# EAGLE design ButtonBoard (EAGLE 9.4.2)
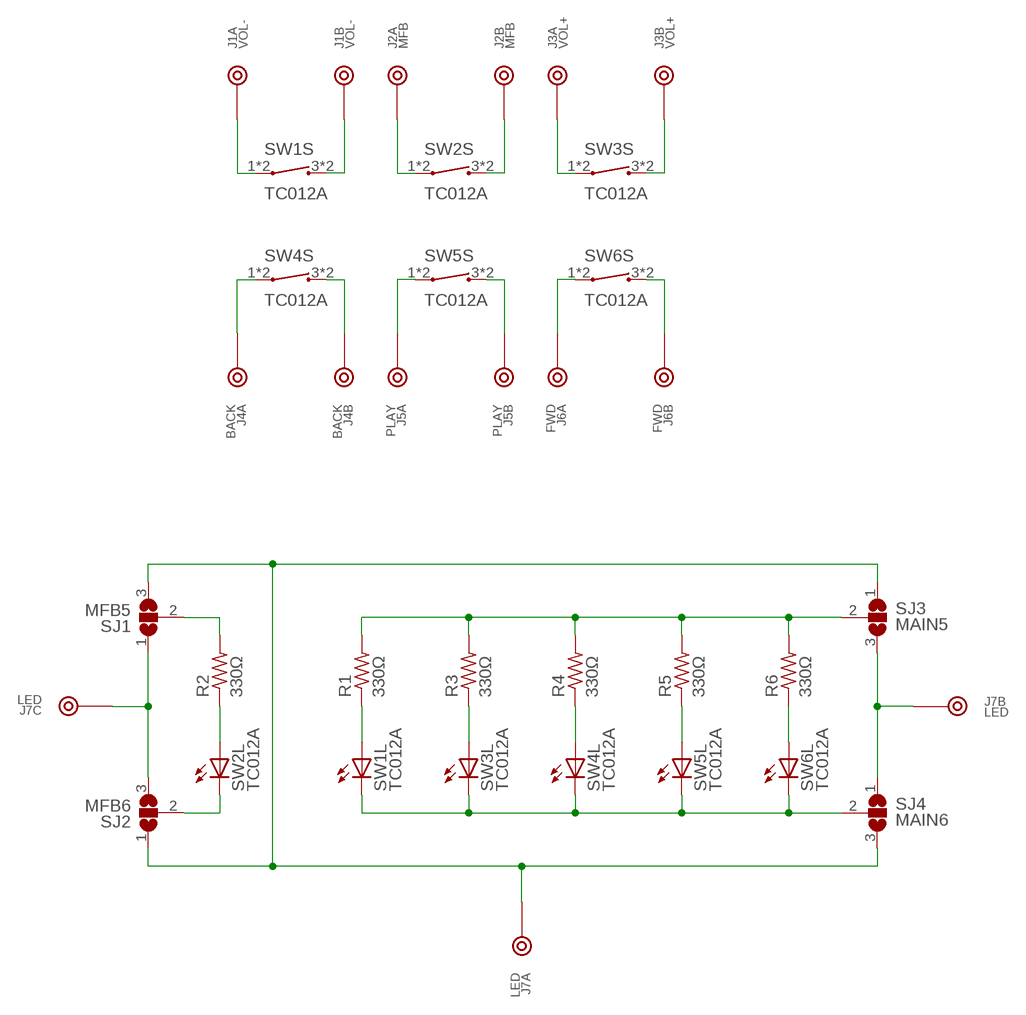
[diagram p0: schematic, sheet 1]

## Parts
J1  VOL-  GEN-2PIN  [2PIN]
J2  MFB  GEN-2PIN  [2PIN]
J3  VOL+  GEN-2PIN  [2PIN]
J4  BACK  GEN-2PIN  [2PIN]
J5  PLAY  GEN-2PIN  [2PIN]
J6  FWD  GEN-2PIN  [2PIN]
J7  LED  GEN-3PIN  [3PIN]
R1  330Ω  R-US_R0805  [R0805]
R2  330Ω  R-US_R0805  [R0805]
R3  330Ω  R-US_R0805  [R0805]
R4  330Ω  R-US_R0805  [R0805]
R5  330Ω  R-US_R0805  [R0805]
R6  330Ω  R-US_R0805  [R0805]
SJ1  MFB5  SJ2W  [SJ_2]
SJ2  MFB6  SJ2W  [SJ_2]
SJ3  MAIN5  SJ2W  [SJ_2]
SJ4  MAIN6  SJ2W  [SJ_2]
SW1  TC012A  [TC012A]
SW2  TC012A  [TC012A]
SW3  TC012A  [TC012A]
SW4  TC012A  [TC012A]
SW5  TC012A  [TC012A]
SW6  TC012A  [TC012A]

## Nets
BACK1: J4.1 SW4.1 SW4.2
BACK2: J4.2 SW4.3 SW4.4
FWD1: J6.1 SW6.1 SW6.2
FWD2: J6.2 SW6.3 SW6.4
LED_5V: J7.1 SJ1.3 SJ2.1 SJ3.1 SJ4.3
LED_BACK_5R: R4.1 SW4.5(L:A)
LED_FWD_5R: R6.1 SW6.5(L:A)
LED_MAIN_5: R1.2 R3.2 R4.2 R5.2 R6.2 SJ3.2
LED_MAIN_6: SJ4.2 SW1.6(L:C) SW3.6(L:C) SW4.6(L:C) SW5.6(L:C) SW6.6(L:C)
LED_MAIN_GND: J7.2 SJ3.3 SJ4.1
LED_MFB_5: R2.2 SJ1.2
LED_MFB_5R: R2.1 SW2.5(L:A)
LED_MFB_6: SJ2.2 SW2.6(L:C)
LED_MFB_GND: J7.3 SJ1.1 SJ2.3
LED_PLAY_5R: R5.1 SW5.5(L:A)
LED_VOL+_5R: R3.1 SW3.5(L:A)
LED_VOL-_5R: R1.1 SW1.5(L:A)
MFB1: J2.1 SW2.1 SW2.2
MFB2: J2.2 SW2.3 SW2.4
PLAY1: J5.1 SW5.1 SW5.2
PLAY2: J5.2 SW5.3 SW5.4
VOL+1: J3.1 SW3.1 SW3.2
VOL+2: J3.2 SW3.3 SW3.4
VOL-1: J1.1 SW1.1 SW1.2
VOL-2: J1.2 SW1.3 SW1.4

## Library data of the parts
J1-J6 = BW-Connectors:GEN-2PIN
J7 = BW-Connectors:GEN-3PIN
R1-R6 = resistor:R-US_: RESISTOR, American symbol
SJ1-SJ4 = jumper:SJ2W: SMD solder JUMPER
SW1-SW6 = BW-PassiveMechanical:TC012A: Illuminated tactile switch

## Board
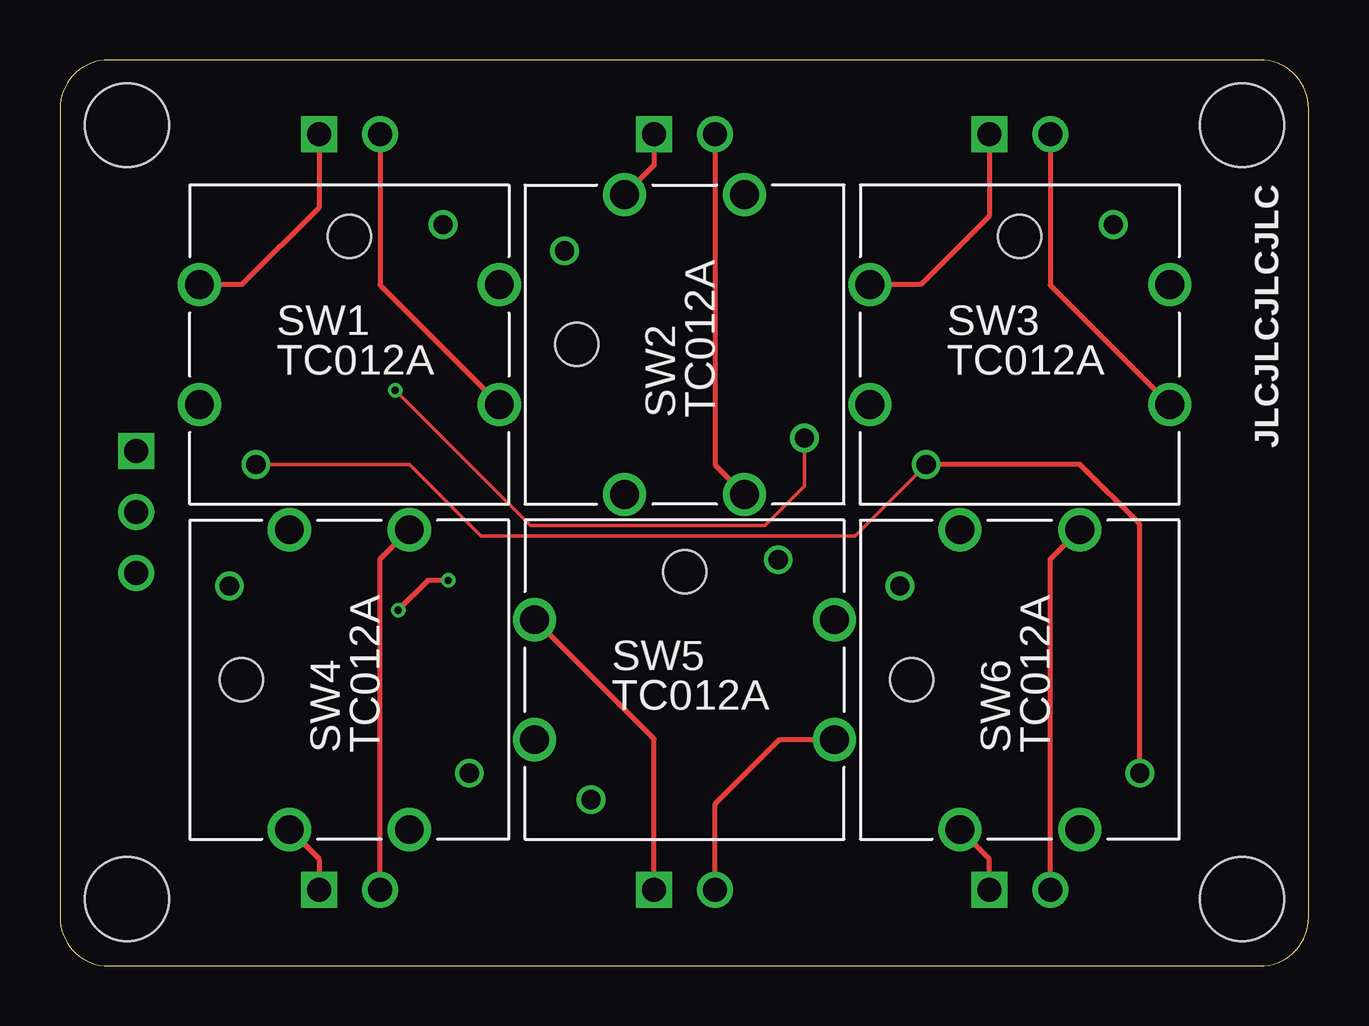
[diagram p1: board, top side]
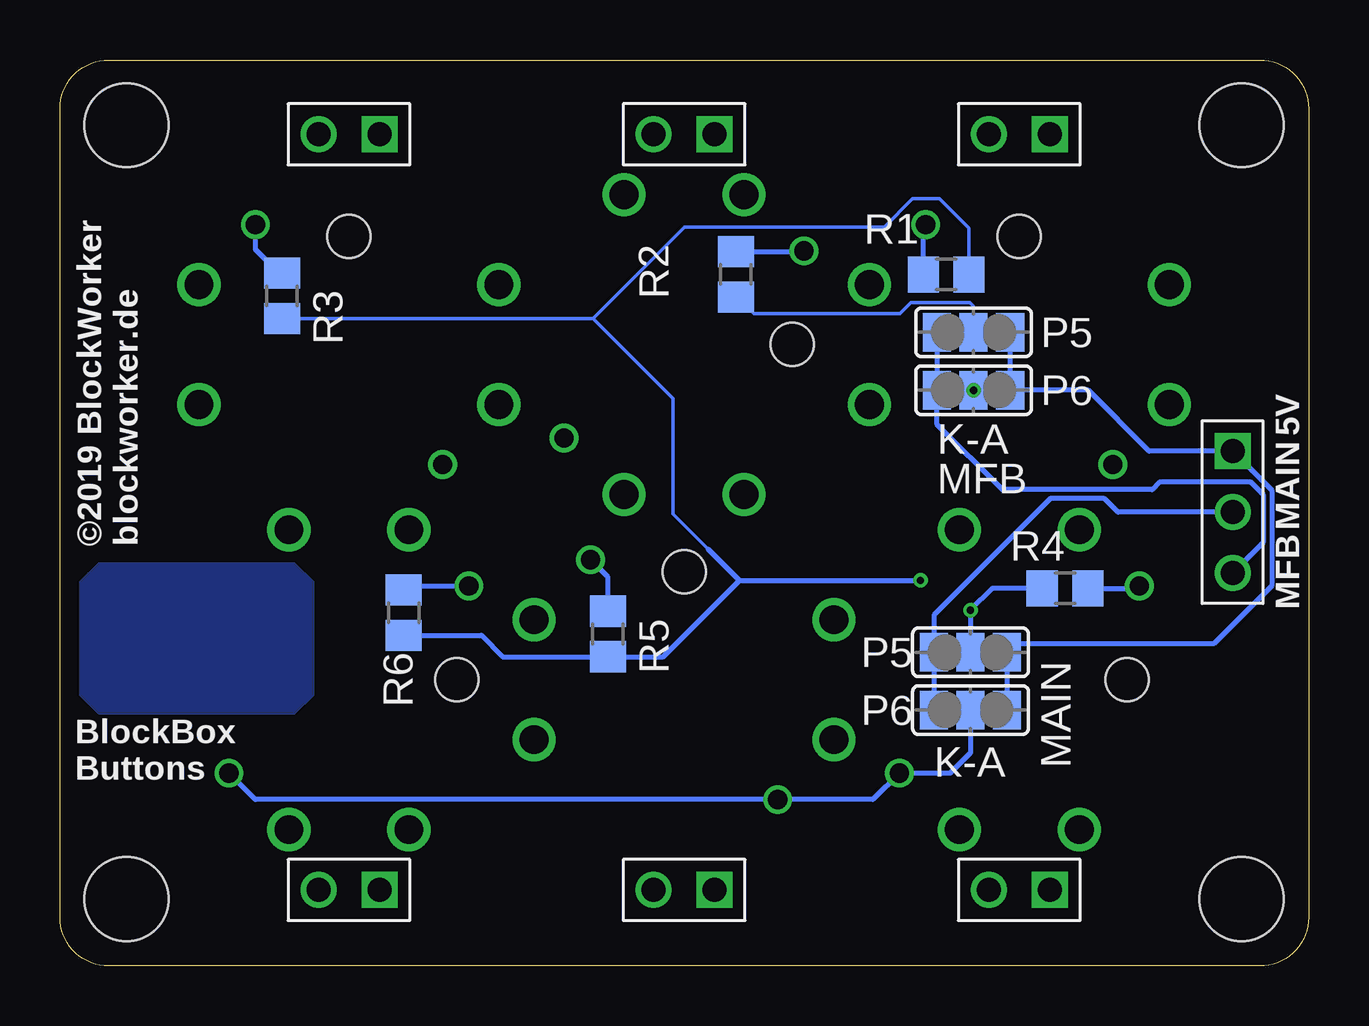
[diagram p2: board, bottom side, seen from below]

Size 52.05 x 37.77 mm. Coordinates in mm from the lower left corner, seen from the top.
Outline: 50.02,37.77 2.03,37.77 arc90 0,35.74 0,2.03 arc90 2.03,0 50.02,0 arc90 52.05,2.03 52.05,35.74 arc90 50.02,37.77
Copper layers (1*16): Top 0.035mm / dielectric 1.5mm / Bottom 0.035mm
Design rules "jlcpcb-2l": minimum track width 5mil, minimum drill 0.3mm, track to track 5mil, track to pad 5mil, pad to pad 5mil, via to via 5mil, smd to smd 0mil, copper to edge 0.25mm, drill to drill 6mil, minimum pad ring 6mil, minimum via ring 6mil, stop-mask expansion 4mil, vias tented up to drill 0.3mm, thermal gap 10mil
Holes 3.5 mm at 2.79,35.05 49.28,35.05 2.79,2.79 49.28,2.79

### Footprints (pad centres in the part's own frame; a part is rotated, then mirrored left to right if it is on the bottom)
2PIN = drill 1 square: 1 -1.27,0 | drill 1: 2 1.27,0
3PIN = drill 1 square: 1 -2.54,0 | drill 1: 2 0,0; 3 2.54,0
R0805 = smd 1.3 x 1.5: 1 -0.95,0; 2 0.95,0
SJ_2 = smd 1.168 x 1.6: 1 -1.524,0; 2 0,0; 3 1.524,0
TC012A = drill 1.2: 1 6.25,2.5; 2 -6.25,2.5; 3 6.25,-2.5; 4 -6.25,-2.5 | drill 0.8: 5 3.9,5; 6 -3.9,-5 | hole 1.8: 0,4.5

### Placement (x,y rotation side)
J1  12.06,34.67 180 bottom
J2  26.04,34.67 180 bottom
J3  40.01,34.67 180 bottom
J4  12.06,3.17 180 bottom
J5  26.04,3.17 180 bottom
J6  40.01,3.17 180 bottom
J7  3.17,18.92 270 bottom
R1  15.11,28.83 0 bottom
R2  23.88,28.83 270 bottom
R3  42.8,27.94 270 bottom
R4  10.16,15.75 180 bottom
R5  29.21,13.84 270 bottom
R6  37.72,14.73 270 bottom
SJ1  13.97,26.42 0 bottom
SJ2  13.97,24 180 bottom
SJ3  14.1,13.08 180 bottom
SJ4  14.1,10.67 0 bottom
SW1  12.06,25.91 0 top
SW2  26.04,25.91 90 top
SW3  40.01,25.91 0 top
SW4  12.06,11.94 90 top
SW5  26.04,11.94 0 top
SW6  40.01,11.94 90 top

### Tracks (layer width: path | path; a pad name or v marks a point on that pad's centre or on a via)
BACK1
  Top 0.203: SW4.2 10.79,4.46 J4.1
BACK2
  Top 0.203: J4.2 13.34,16.96 SW4.3
FWD1
  Top 0.203: J6.1 38.73,4.46 SW6.2
FWD2
  Top 0.203: J6.2 41.27,16.96 SW6.3
LED_5V
  Bottom 0.203: SJ1.3 SJ2.1 9.2,24 6.66,21.46 J7.1 1.55,19.84 1.55,15.85 3.96,13.44 12.22,13.44 SJ3.1 SJ4.3
LED_BACK_5R
  Bottom 0.203: R4.1 7.16,15.75 SW4.5
LED_FWD_5R
  Bottom 0.203: R6.1 37.56,15.84 SW6.5
LED_MAIN_5  (via drill 0.3)
  Top 0.203: v16.18,16.08 15.34,16.08 v14.1,14.83
  Bottom 0.152: R3.2 29.83,26.99 | R1.2 14.16,30.75 15.39,31.98 16.51,31.98 17.68,30.81 26.01,30.81 29.83,26.99 | 25.02,17.37 26.49,18.85 26.49,23.65 29.83,26.99
  Bottom 0.203: R4.2 13.18,15.75 v14.1,14.83 SJ3.2 | 23.72,16.08 26.91,12.89 R5.2 33.59,12.89 34.48,13.78 R6.2 | 23.72,16.08 v16.18,16.08 | 23.72,16.08 25.02,17.37
LED_MAIN_6
  Top 0.152: SW3.6 33.13,17.93 17.55,17.93 14.58,20.91 SW1.6
  Top 0.203: SW6.6 45.01,18.42 42.52,20.91 SW3.6
  Bottom 0.203: SJ4.2 14.1,8.89 14.95,8.04 SW4.6 18.16,6.94 SW5.6 43.91,6.94 SW6.6
LED_MAIN_GND
  Bottom 0.203: J7.2 7.95,18.92 8.51,19.48 10.77,19.48 15.62,14.63 SJ3.3 SJ4.1
LED_MFB_5
  Bottom 0.152: SJ1.2 13.97,27.51 14.12,27.66 16.59,27.66 17.04,27.2 23.11,27.2 23.79,27.88 R2.2
LED_MFB_5R
  Bottom 0.203: R2.1 21.06,29.78 SW2.5
LED_MFB_6  (via drill 0.3)
  Top 0.152: SJ2.2 19.61,18.36 29.39,18.36 31.04,20.01 SW2.6
  other vias: 13.97,24
LED_MFB_GND
  Bottom 0.203: J7.3 1.88,17.68 1.88,19.63 2.41,20.17 6.22,20.17 6.53,19.86 12.78,19.86 15.49,22.58 SJ2.3 SJ1.1
LED_PLAY_5R
  Bottom 0.203: R5.1 29.21,16.21 SW5.5
LED_VOL+_5R
  Bottom 0.203: R3.1 42.91,28.89 43.91,29.88 SW3.5
LED_VOL-_5R
  Bottom 0.203: R1.1 16.06,30.81 SW1.5
LOGO
  pour Bottom: 42.29,16.76 41.53,16 41.53,15.62 41.53,11.3 42.29,10.54 50.42,10.54 51.18,11.3 51.18,16 50.42,16.76
MFB1
  Top 0.203: J2.1 24.77,33.39 SW2.1
MFB2
  Top 0.203: J2.2 27.3,20.89 SW2.4
PLAY1
  Top 0.203: J5.1 24.77,9.46 SW5.2
PLAY2
  Top 0.203: J5.2 27.3,6.76 29.99,9.44 SW5.3
VOL+1
  Top 0.203: J3.1 38.73,31.27 35.88,28.41 SW3.2
VOL+2
  Top 0.203: J3.2 41.27,28.39 SW3.3
VOL-1
  Top 0.203: J1.1 10.79,31.62 7.58,28.41 SW1.2
VOL-2
  Top 0.203: J1.2 13.34,28.39 SW1.3

### Text on the board
tPlace: JLCJLCJLCJLC
bPlace: P5 | P6 | 5V | K-A | MFB | MAIN | ©2019 BlockWorker / blockworker.de | MFB | P5 | P6 | MAIN | K-A | BlockBox / Buttons